# EAGLE design H1BR7 (EAGLE 9.6.1)

## Sheet 1 of 2
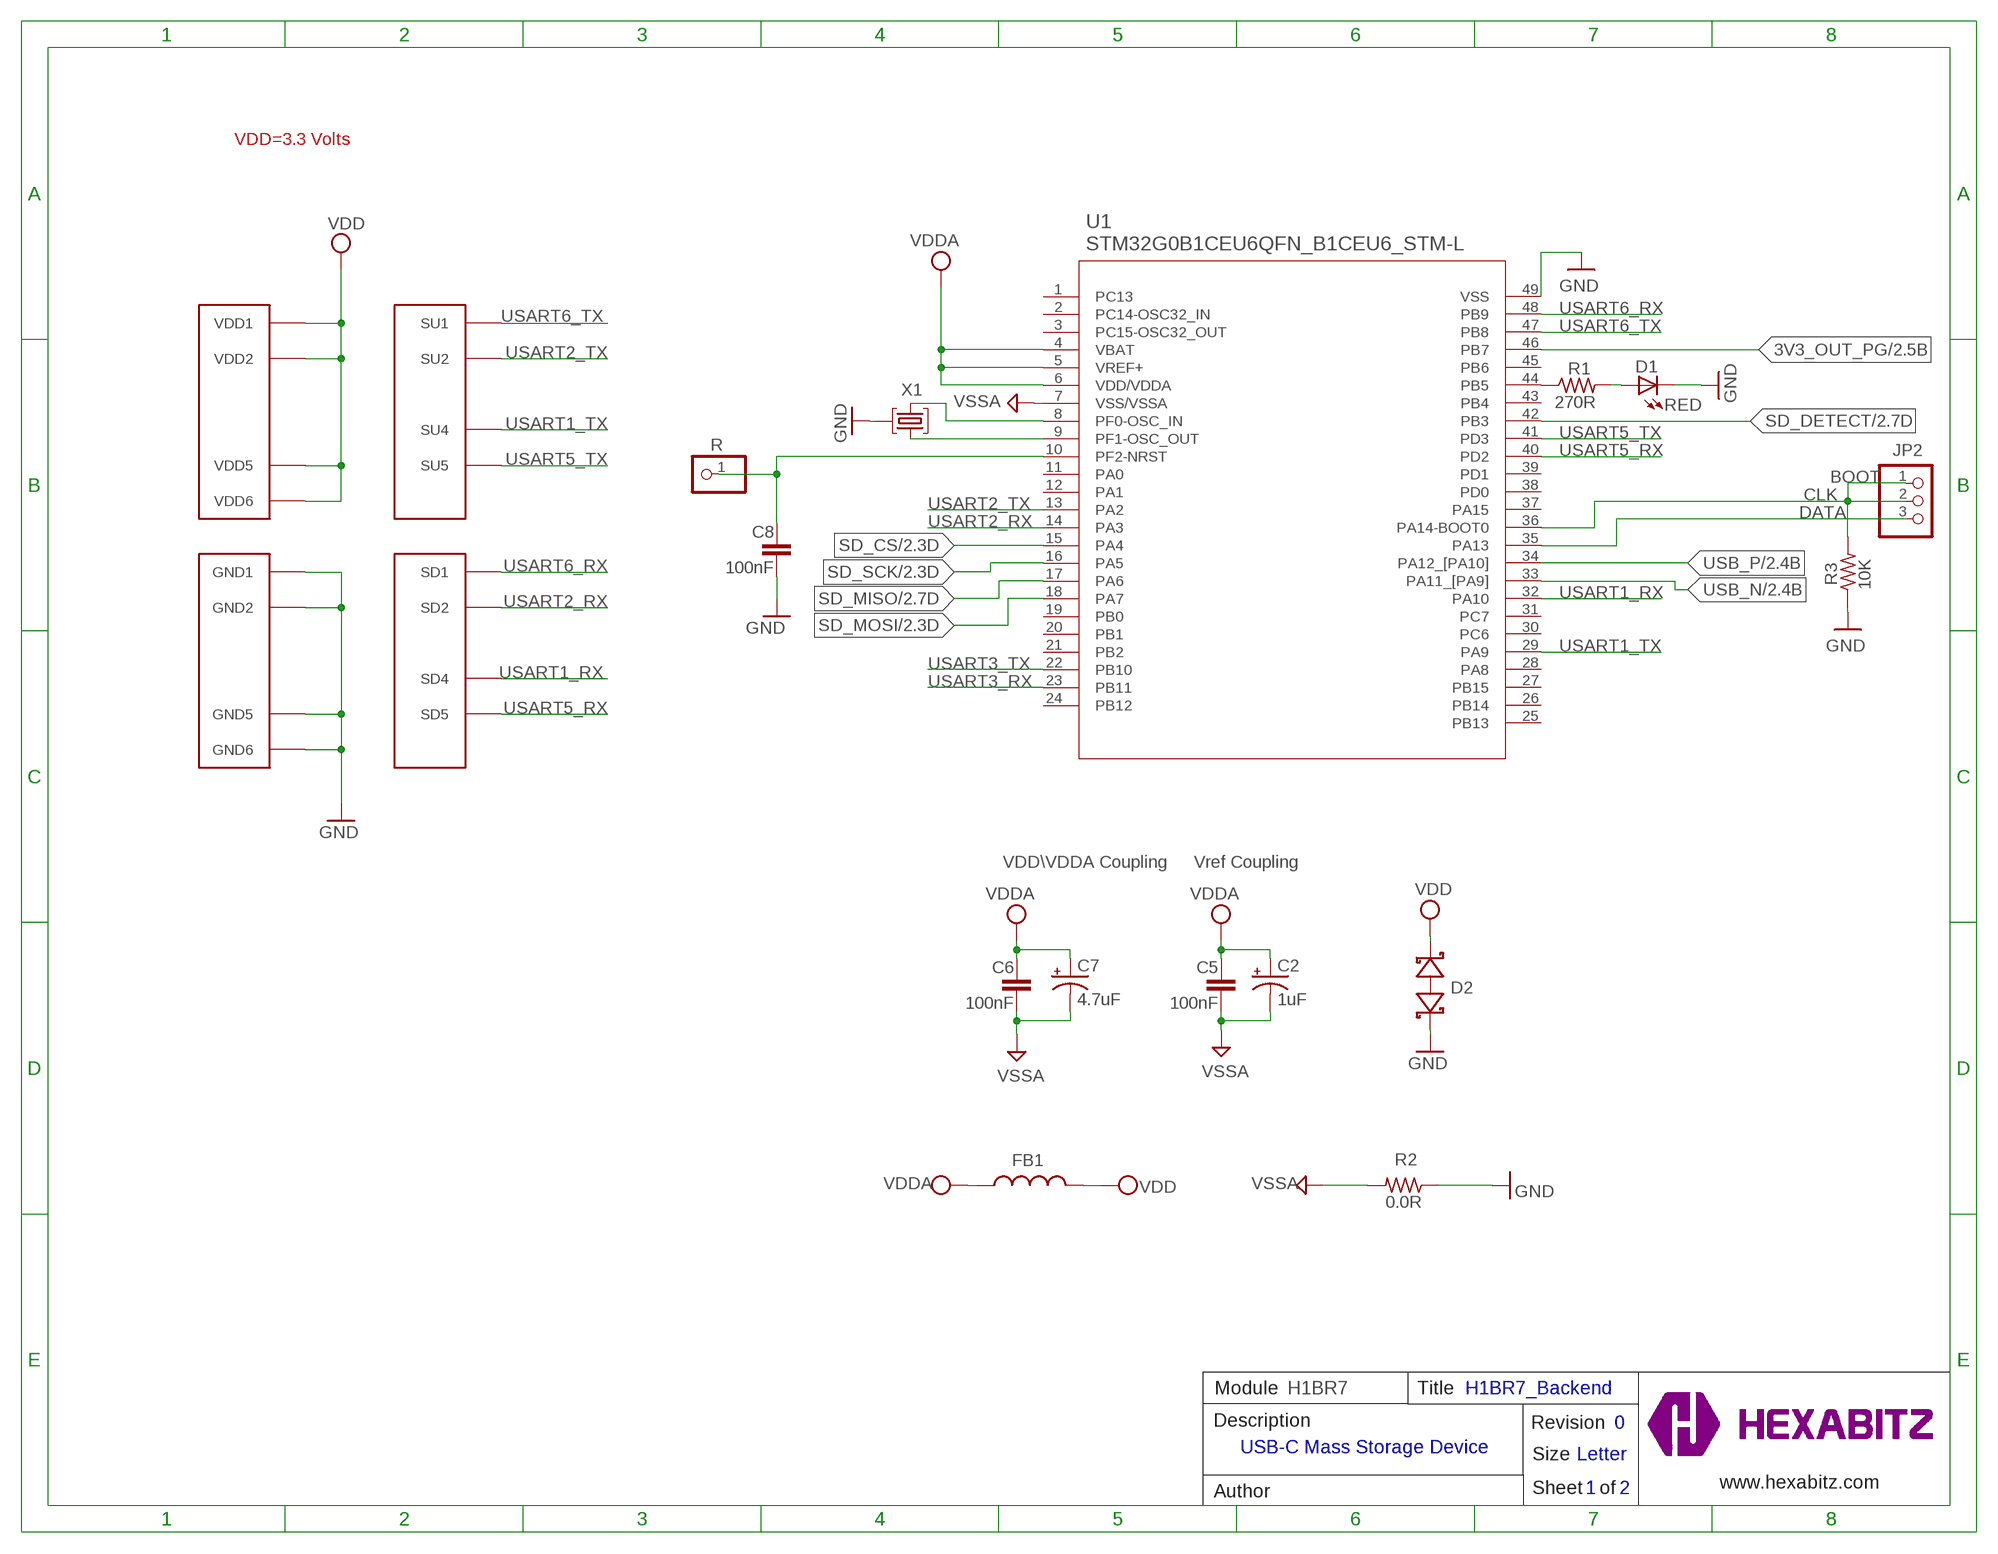
[diagram p0: schematic, sheet 1]

### Parts
C2  1uF  C-0805-POL  [C-0805-POL]
C5  100nF  C-0603  [C-0603]
C6  100nF  C-0603  [C-0603]
C7  4.7uF  C-0805-POL  [C-0805-POL]
C8  100nF  C-0603  [C-0603]
D1  RED  VLMS1300-GS08  [VLMS1300-GS08]
D2  BOURNS_CDSOD323-T03SCBOURNS_CDSOD323-T03SC_0_0  [BOURNS_CDSOD323-T03SC_0]
FB1  FB-TDK_MMZ1608Y300B  [FB-TDK_MMZ1608Y300B]
JP2  PINHD-1X3  [1X03]
P1  HEXABIT_HEXABIT_?_NO_P3_P6_P9_P10  HEXABIT_HEXABIT_?_NO_P3_P6_P9_P10_NO_P3_P6_P9_P10  [HEXABIT_?_NO_P3_P6_P9_P10]
R  R  PINHD-1X1  [1X01]
R1  270R  R-0603  [R-0603]
R2  0.0R  R-0603  [R-0603]
R3  10K  R-0603  [R-0603]
TRIMBLE-LOGO1  HEXA-LOGO  [HEXA-LOGO]
U1  STM32G0B1CEU6QFN_B1CEU6_STM-L  [QFN_B1CEU6_STM-L]
X1  XTALL_CSTCE8M00G52  [XTALL_CSTCE8M00G52]

### Nets
3V3_OUT_PG: U1.46(PB7) ; also sheet 2
CLK: JP2.1 JP2.2 R3.2 U1.36(PA14-BOOT0)
DATA: JP2.3 U1.35(PA13)
GND: C8.2 D1.C D2.1(A) P1.PAD_PD7(GND1) P1.PAD_PD8(GND2) P1.PAD_PD11(GND5) P1.PAD_PD12(GND6) R2.1 R3.1 U1.49(VSS) X1.P$2 ; also sheet 2
N$2: R1.1 U1.44(PB5)
N$3: D1.A R1.2
N$4: C8.1 R.1 U1.10(PF2-NRST)
N$5: U1.9(PF1-OSC_OUT) X1.P$1
N$6: U1.8(PF0-OSC_IN) X1.P$3
SD_CS: U1.15(PA4) ; also sheet 2
SD_DETECT: U1.42(PB3) ; also sheet 2
SD_MISO: U1.17(PA6) ; also sheet 2
SD_MOSI: U1.18(PA7) ; also sheet 2
SD_SCK: U1.16(PA5) ; also sheet 2
USART1_RX: P1.PAD_PD4(SD4) U1.32(PA10)
USART1_TX: P1.PAD_PU4(SU4) U1.29(PA9)
USART2_RX: P1.PAD_PD2(SD2) U1.14(PA3)
USART2_TX: P1.PAD_PU2(SU2) U1.13(PA2)
USART3_RX: U1.23(PB11)
USART3_TX: U1.22(PB10)
USART5_RX: P1.PAD_PD5(SD5) U1.40(PD2)
USART5_TX: P1.PAD_PU5(SU5) U1.41(PD3)
USART6_RX: P1.PAD_PD1(SD1) U1.48(PB9)
USART6_TX: P1.PAD_PU1(SU1) U1.47(PB8)
USB_N: U1.33(PA11_[PA9]) ; also sheet 2
USB_P: U1.34(PA12_[PA10]) ; also sheet 2
VDD: D2.2(C) FB1.2 P1.PAD_PU7(VDD1) P1.PAD_PU8(VDD2) P1.PAD_PU11(VDD5) P1.PAD_PU12(VDD6) ; also sheet 2
VDDA: C2.1(+) C5.1 C6.1 C7.1(+) FB1.1 U1.4(VBAT) U1.5(VREF+) U1.6(VDD/VDDA)
VSSA: C2.2(-) C5.2 C6.2 C7.2(-) R2.2 U1.7(VSS/VSSA)
Unconnected: U1.1(PC13) U1.2(PC14-OSC32_IN) U1.3(PC15-OSC32_OUT) U1.11(PA0) U1.12(PA1) U1.19(PB0) U1.20(PB1) U1.21(PB2) U1.24(PB12) U1.25(PB13) U1.26(PB14) U1.27(PB15) U1.28(PA8) U1.30(PC6) U1.31(PC7) U1.37(PA15) U1.38(PD0) U1.39(PD1) U1.43(PB4) U1.45(PB6)

### Notes on the sheet
- VDD=3.3 Volts
- BOOT
- VDD\VDDA Coupling | Vref Coupling
- Module | H1BR7 | Title | H1BR7_Backend
- Description | Revision | 0
- USB-C Mass Storage Device
- Size | Letter
- www.hexabitz.com
- Author | Sheet   of | 1 | 2
- C:/Users/Admin/Desktop/logodraft.bmp

## Sheet 2 of 2
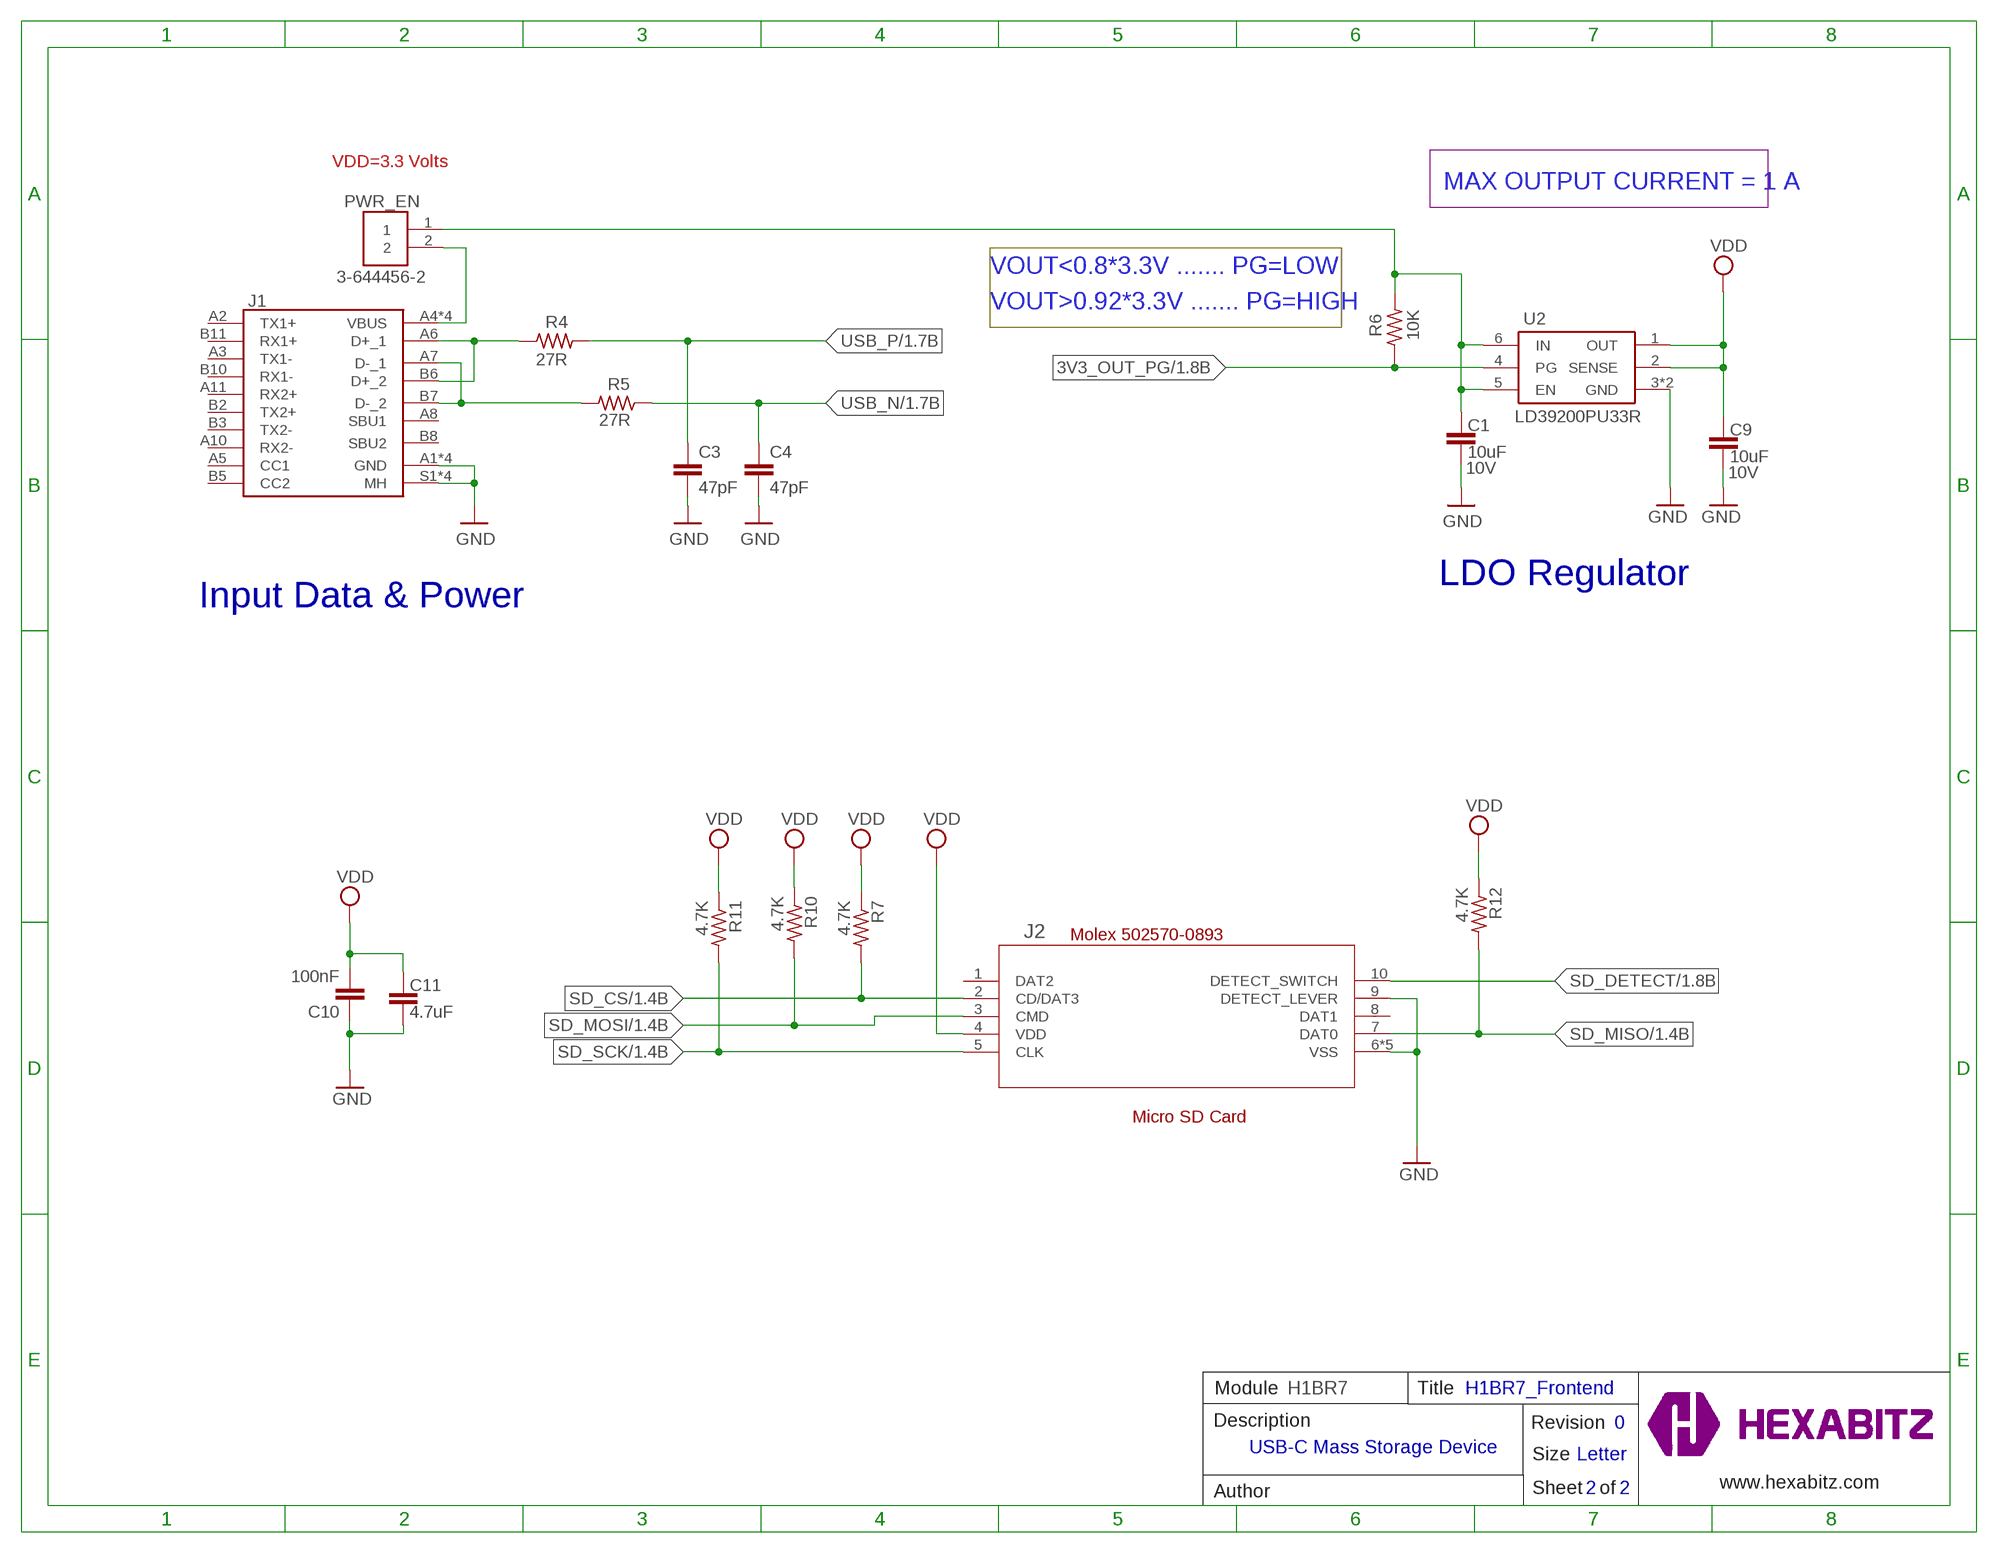
[diagram p1: schematic, sheet 2]

### Parts
C1  10uF  C-0805  [C-0805]
C3  47pF  C-0603  [C-0603]
C4  47pF  C-0603  [C-0603]
C9  10uF  C-0805  [C-0805]
C10  100nF  C-0603  [C-0603]
C11  4.7uF  C-0805  [C-0805]
J1  12401610E4#2A12401610E42A  [AMPHENOL_12401610E4_2A]
J2  5025700893502570-0893_MOL  [502570-0893_MOL]
PWR_EN  3-644456-2  [TE_3-644456-2]
R4  27R  R-0603  [R-0603]
R5  27R  R-0603  [R-0603]
R6  10K  R-0603  [R-0603]
R7  4.7K  R-0603  [R-0603]
R10  4.7K  R-0603  [R-0603]
R11  4.7K  R-0603  [R-0603]
R12  4.7K  R-0603  [R-0603]
U2  LD39200PU33R  [SON95P300X300X100-7N]

### Nets
3V3_OUT_PG: R6.1 U2.4(PG) ; also sheet 1
D_N: J1.A7(D-_1) J1.B7(D-_2) R5.2
D_P: J1.A6(D+_1) J1.B6(D+_2) R4.1
GND: C1.1 C3.2 C4.2 C9.1 C10.1 C11.1 J1.A1(GND) J1.A12(GND) J1.B1(GND) J1.B12(GND) J1.S1(MH) J1.S2(MH) J1.S3(MH) J1.S4(MH) J2.6(VSS) J2.9(DETECT_LEVER) J2.11(VSS) J2.12(VSS) J2.13(VSS) J2.14(VSS) U2.3(GND) U2.7(GND) ; also sheet 1
N$1: C1.2 PWR_EN.1 R6.2 U2.5(EN) U2.6(IN)
N$8: J1.A4(VBUS) J1.A9(VBUS) J1.B4(VBUS) J1.B9(VBUS) PWR_EN.2
SD_CS: J2.2(CD/DAT3) R7.2 ; also sheet 1
SD_DETECT: J2.10(DETECT_SWITCH) ; also sheet 1
SD_MISO: J2.7(DAT0) R12.2 ; also sheet 1
SD_MOSI: J2.3(CMD) R10.2 ; also sheet 1
SD_SCK: J2.5(CLK) R11.2 ; also sheet 1
USB_N: C4.1 R5.1 ; also sheet 1
USB_P: C3.1 R4.2 ; also sheet 1
VDD: C9.2 C10.2 C11.2 J2.4(VDD) R7.1 R10.1 R11.1 R12.1 U2.1(OUT) U2.2(SENSE) ; also sheet 1
Unconnected: J1.A2(TX1+) J1.A3(TX1-) J1.A5(CC1) J1.A8(SBU1) J1.A10(RX2-) J1.A11(RX2+) J1.B2(TX2+) J1.B3(TX2-) J1.B5(CC2) J1.B8(SBU2) J1.B10(RX1-) J1.B11(RX1+) J2.1(DAT2) J2.8(DAT1)

### Notes on the sheet
- VDD=3.3 Volts
- MAX OUTPUT CURRENT = 1 A
- VOUT<0.8*3.3V ....... PG=LOW
- VOUT>0.92*3.3V ....... PG=HIGH
- LDO Regulator
- Input Data & Power
- Molex 502570-0893
- Micro SD Card
- Module | H1BR7 | Title | H1BR7_Frontend
- Description | Revision | 0
- USB-C Mass Storage Device
- Size | Letter
- www.hexabitz.com
- Author | Sheet   of | 2 | 2

## Library data of the parts
C1 C9 C11 = HEXABITZ_RCLS:C-0805: CAP CER 10% X7R 0805; MPN: GRM187R61A226ME15; VOLTAGE_RATING: 10V
C2 C7 = HEXABITZ_RCLS:C-0805-POL: Cap Tant Solid SMD 2012
C3-C6 C8 = HEXABITZ_RCLS:C-0603: CAP CER 10% X7R 0603
C10 = HEXABITZ_RCLS:C-0603: CAP CER 10% X7R 0603; CAPACITANCE: 100nF; MFN: AVX CORPORATION; MPN: '0603YC104K4T2A; OCTOPART_URL: 'https://octopart.com/0603yc104k4t2a-avx+interconnect+%2F+elco-8120651; TOLERANCE: 10%; VOLTAGE_RATING: 16.0 V
D1 = Hexabitz:VLMS1300-GS08: Red 0603 130° Clear 54 mcd 2 V Surface Mount ChipLED ; Octopart Url : http://octopart.com/vlms1300-gs08-vishay-21709201; MFN: Vishay; MPN: VLMS1300-GS08; OCTOPART_URL: https://octopart.com/vlms1300-gs08-vishay-21709201?r=sp&s=_gcP4_q8T1SC6PJQPTQ9yA
D2 = HEXABITZ_RCLS:BOURNS_CDSOD323-T03SC: CDSOD323-TxxSC - TVS Diode Series; DESCRIPTION: Dio Tvs Vwm 03V 500W Bidir Sod323 / Tape & Reel - 7" Reel; MFN: Bourns; MPN: CDSOD323-T03SC; OCTOPART_URL: https://octopart.com/cdsod323-t03sc-bourns-10487153?r=sp
FB1 = HEXABITZ_RCLS:FB-TDK_MMZ1608Y300B: Ferrite Beads Multi-Layer 30Ohm 25% 100MHz 1.5A 50mOhm DCR 0603; MFN: TDK; MPN: MMZ1608Y300B; OCTOPART_URL: https://octopart.com/mmz1608y300b-tdk-368280?r=sp&s=cd9_2ZEqQ9q9UNBuQgHAiA
J1 = HEXABITZ_CONNECTION_PARTS:12401610E4#2A: USB3.2 GEN2, Type C, Top mount, CH 1.58mm, Dual Row SMT Source: Datasheet <https://cdn.amphenol-cs.com/media/wysiwyg/files/drawing/c12401610_c.pdf>
J2 = HEXABITZ_CONNECTION_PARTS:5025700893; COPYRIGHT: Copyright (C) 2022 Ultra Librarian. All rights reserved.; DIGI-KEY_PART_NUMBER_1: WM19093TR-ND; DIGI-KEY_PART_NUMBER_2: WM19093CT-ND; DIGI-KEY_PART_NUMBER_3: WM19093DKR-ND; DIGI-KEY_PART_NUMBER_4: WM19093TR-NDL; MANUFACTURER_PART_NUMBER: 5025700893; MFR_NAME: Molex Connector Corporation; OCTOPART_URL: https://octopart.com/502570-0893-molex-42270318?r=sp
JP2 = pinhead:PINHD-1X3: PIN HEADER
P1 = hexabitz_connectors:HEXABIT_?_NO_P3_P6_P9_P10: Hexabitz Hexagon Module Connector Hexagon side length = 17.32mm. The following ports are removed: P3 P6 P9 P10
PWR_EN = HEXABITZ_USER_INTERFACE_PARTS:3-644456-2; AVAILABILITY: Unavailable; CENTERLINE_PITCH: 2.54 mm[.1 in]; COMMENT: 3-644456-2; DESCRIPTION: Connector Unshrouded Header HDR 2 Position 2.54mm Solder Straight Thru-Hole; EU_ROHS_COMPLIANCE: Compliant; MF: TE Connectivity; MFN: TE Connectivity; MP: 3-644456-2; MPN: 87224-1; NUMBER_OF_POSITIONS: 2; OCTOPART_URL: https://octopart.com/87224-1-te+connectivity-39512011?r=sp; PACKAGE: None; PRICE: None; PRODUCT_TYPE: Connector; TE_PURCHASE_URL: https://www.te.com/usa-en/product-3-644456-2.html?te_bu=Cor&te_type=disp&te_campaign=seda_glo_cor-seda-global-disp-prtnr-fy19-seda-model-bom-cta_sma-317_1&elqCampaignId=32493
R = HEXABITZ_USER_INTERFACE_PARTS:PINHD-1X1: PIN HEADER; MFN: TE Connectivity; MPN: 87227-1; OCTOPART_URL: https://octopart.com/87227-1-te+connectivity-39512052?r=sp
R1 R3 = HEXABITZ_RCLS:R-0603: Thick Film Resistors - SMD 0603
R2 = HEXABITZ_RCLS:R-0603: Thick Film Resistors - SMD 0603; MFN: Yageo; MPN: RC0603JR-070RL; OCTOPART_URL: https://octopart.com/rc0603jr-070rl-yageo-1241539?r=sp&s=X2NteqRjRNWrnx42Y0aliA; RESISTANCE: 0.0 Ohm
R4-R6 = HEXABITZ_RCLS:R-0603: Thick Film Resistors - SMD 0603; TOLERANCE: 1%
R7 R10-R12 = HEXABITZ_RCLS:R-0603: Thick Film Resistors - SMD 0603; MFN: YAGED [VA]; MPN: RC0603JR-074K7L; OCTOPART_URL: 'https://octopart.com/rc0603jr-074k7l-yageo-55458509?r=sp; RESISTANCE: 4700 Ohm; TOLERANCE: 5%
TRIMBLE-LOGO1 = HEXABITZ_USER_INTERFACE_PARTS:HEXA-LOGO: Trimble-Logo
U1 = HEXABITZ_ICs:STM32G0B1CEU6; COPYRIGHT: Copyright (C) 2021 Ultra Librarian. All rights reserved.; MANUFACTURER_PART_NUMBER: STM32G0B1CEU6; MFR_NAME: STMicroelectronics
U2 = HEXABITZ_ICs:LD39200PU33R: LDO Voltage Regulators 2 A high PSRR ultra low drop linear regulator with reverse current protection Source: Datasheet <https://www.st.com/resource/en/datasheet/ld39200.pdf>; DESCRIPTION: LDO Voltage Regulators 2 A high PSRR ultra low drop linear regulator with reverse current protection; HEIGHT: 1mm; MANUFACTURER_NAME: STMicroelectronics; MANUFACTURER_PART_NUMBER: LD39200PU33R; MOUSER_PART_NUMBER: 511-LD39200PU33R; MOUSER_PRICE-STOCK: https://www.mouser.co.uk/ProductDetail/STMicroelectronics/LD39200PU33R?qs=WHlX%252B%252B9%2FRwAl6%2FJDqRS1uw%3D%3D
X1 = Hexabitz:XTALL_CSTCE8M00G52: MURATA CSTCE8M00G52-R0 RESONATOR, SMD, 8MHZ ; Octopart Url : https://octopart.com/cstce8m00g52-r0-murata-7145559; MFN: Murata; MPN: CSTCE8M00G52Z-R0; OCTOPART_URL: https://octopart.com/cstce8m00g52z-r0-murata-17755941?r=sp&s=JDnNJnrHQhyS8Zk4ofFWXw

## Board
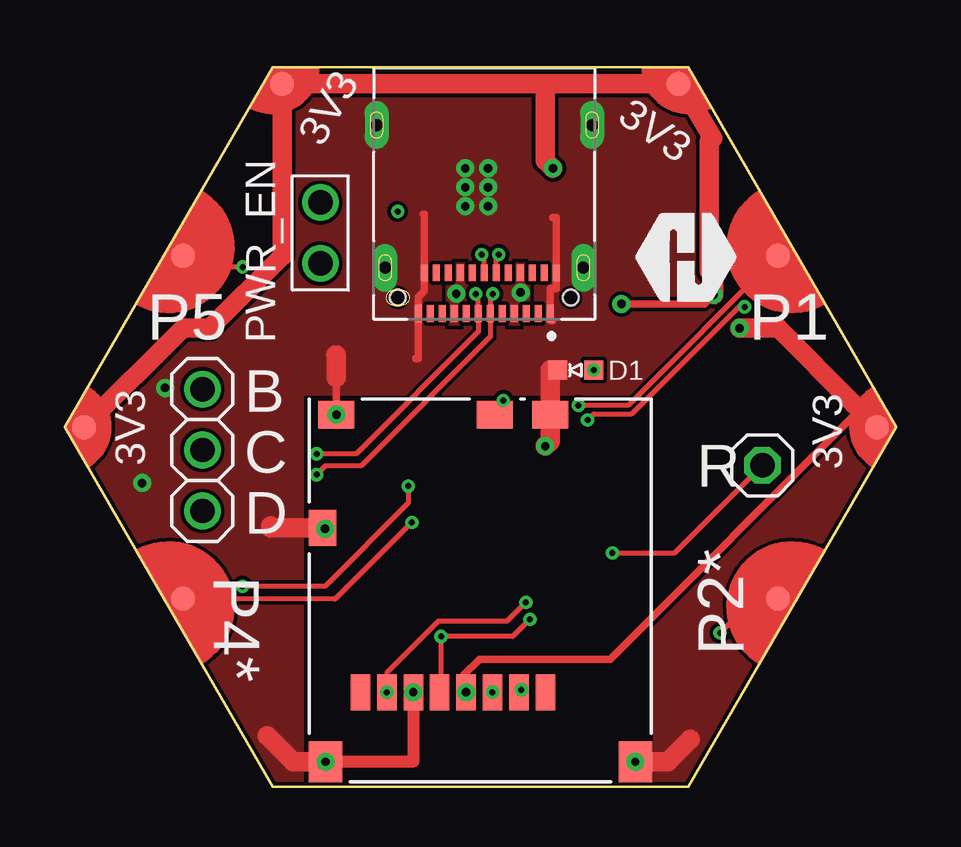
[diagram p2: board, top side]
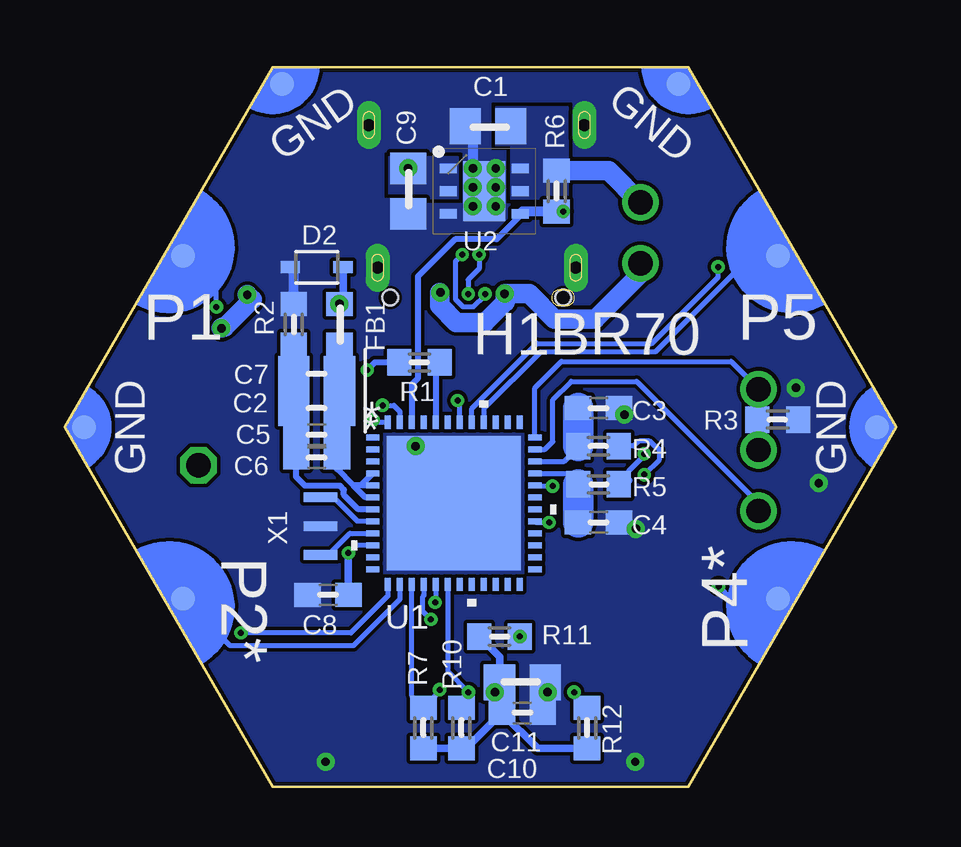
[diagram p3: board, bottom side, seen from below]

Size 34.64 x 30 mm. Coordinates in mm from the lower left corner, seen from the top.
Copper layers (1*16): Top 0.035mm / dielectric 1.5mm / Bottom 0.035mm
Design rules "default *": minimum track width 6mil, minimum drill 0.25mm, track to track 6mil, track to pad 6mil, pad to pad 6mil, via to via 6mil, smd to smd 0mil, copper to edge 0.15mm, drill to drill 1mil, minimum pad ring 10mil, minimum via ring 6mil, stop-mask expansion 4mil, vias tented up to drill 25mil, thermal gap 10mil

### Footprints (pad centres in the part's own frame; a part is rotated, then mirrored left to right if it is on the bottom)
C-0805 = smd 1.3 x 1.5: 1 -0.95,0; 2 0.95,0
C-0805-POL = smd 1.3 x 1.5: 1 -0.95,0; 2 0.95,0
C-0603 = smd 1.1 x 1: 1 -0.85,0; 2 0.85,0
VLMS1300-GS08 = smd 0.8 x 0.8: A 0,0.75; C 0,-0.75
BOURNS_CDSOD323-T03SC_0 = smd 0.8 x 0.5: 1 -1.1,0; 2 1.1,0
FB-TDK_MMZ1608Y300B = smd 1 x 1.1: 1 -0.85,0; 2 0.85,0
AMPHENOL_12401610E4_2A = smd 0.29 x 0.7: A1 -2.75,0.66; A2 -2.25,0.66; A3 -1.75,0.66; A4 -1.25,0.66; A5 -0.75,0.66; A6 -0.25,0.66; A7 0.25,0.66; A8 0.75,0.66; A9 1.25,0.66; A10 1.75,0.66; A11 2.25,0.66; A12 2.75,0.66; B1 2.5,-1.04; B2 2,-1.04; B3 1.5,-1.04; B4 1,-1.04; B5 0.5,-1.04; B6 0,-1.04; B7 -0.5,-1.04; B8 -1,-1.04; B9 -1.5,-1.04; B10 -2,-1.04; B11 -2.5,-1.04; B12 -3,-1.04 | drill 0.5 pad 0.8 long: S1 -4.13,-1.25; S2 4.13,-1.25; S3 4.49,-7.2; S4 -4.49,-7.2 | hole 0.65: -3.6,0; 3.6,0
502570-0893_MOL = smd 0.813 x 1.499: 1 -2.7,4.249; 2 -1.6,4.249; 3 -0.5,4.249; 4 0.6,4.249; 5 1.7,4.249; 6 2.8,4.249; 7 3.9,4.249; 8 5,4.249 | smd 1.143 x 1.499: 9 6.575,-2.601 | smd 1.499 x 1.143: 10 -0.6,-7.326; 13 -2.9,-7.326; 14 6,-7.326 | smd 1.397 x 1.702: 11 -6.45,7.149; 12 6.45,7.149
1X03 = drill 1.016: 1 -2.54,0; 2 0,0; 3 2.54,0
HEXABIT_?_NO_P3_P6_P9_P10 = smd 1 x 1 bottom: PAD_PD1 12.39,7.15; PAD_PD2 12.39,-7.15; PAD_PD4 -12.39,-7.15; PAD_PD5 -12.39,7.15; PAD_PD7 8.26,14.31; PAD_PD8 16.52,0; PAD_PD11 -16.52,0; PAD_PD12 -8.26,14.31 | smd 1 x 1: PAD_PU1 12.39,7.15; PAD_PU2 12.39,-7.15; PAD_PU4 -12.39,-7.15; PAD_PU5 -12.39,7.15; PAD_PU7 8.26,14.31; PAD_PU8 16.52,0; PAD_PU11 -16.52,0; PAD_PU12 -8.26,14.31
TE_3-644456-2 = drill 1.02 pad 1.37: 1 0,0; 2 2.54,0
1X01 = drill 1.016 octagon: 1 0,0
R-0603 = smd 1 x 1.1: 1 -0.85,0; 2 0.85,0
QFN_B1CEU6_STM-L = smd 0.55 x 0.254: 1 -3.38,2.751; 2 -3.38,2.251; 3 -3.38,1.75; 4 -3.38,1.25; 5 -3.38,0.75; 6 -3.38,0.25; 7 -3.38,-0.25; 8 -3.38,-0.75; 9 -3.38,-1.25; 10 -3.38,-1.75; 11 -3.38,-2.251; 12 -3.38,-2.751; 25 3.38,-2.751; 26 3.38,-2.251; 27 3.38,-1.75; 28 3.38,-1.25; 29 3.38,-0.75; 30 3.38,-0.25; 31 3.38,0.25; 32 3.38,0.75; 33 3.38,1.25; 34 3.38,1.75; 35 3.38,2.251; 36 3.38,2.751 | smd 0.254 x 0.55: 13 -2.751,-3.38; 14 -2.251,-3.38; 15 -1.75,-3.38; 16 -1.25,-3.38; 17 -0.75,-3.38; 18 -0.25,-3.38; 19 0.25,-3.38; 20 0.75,-3.38; 21 1.25,-3.38; 22 1.75,-3.38; 23 2.251,-3.38; 24 2.751,-3.38; 37 2.751,3.38; 38 2.251,3.38; 39 1.75,3.38; 40 1.25,3.38; 41 0.75,3.38; 42 0.25,3.38; 43 -0.25,3.38; 44 -0.75,3.38; 45 -1.25,3.38; 46 -1.75,3.38; 47 -2.251,3.38; 48 -2.751,3.38 | smd 5.6 x 5.6: 49 0,0
SON95P300X300X100-7N = smd 0.7 x 0.4: 1 -1.5,0.95; 2 -1.5,0; 3 -1.5,-0.95; 4 1.5,-0.95; 5 1.5,0; 6 1.5,0.95 | smd 1.75 x 2.5: 7 0,0
XTALL_CSTCE8M00G52 = smd 1.4 x 0.4: P$1 0,1.2; P$2 0,0; P$3 0,-1.2

### Placement (x,y rotation side)
C1  17,27.54 0 bottom
C2  24.15,15.79 180 bottom
C3  12.4,15.79 0 bottom
C4  12.4,11.03 0 bottom
C5  24.15,14.68 180 bottom
C6  24.15,13.73 180 bottom
C7  24.15,17.22 180 bottom
C8  23.67,8.01 180 bottom
C9  20.34,24.84 90 bottom
C10  15.57,3.09 180 bottom
C11  15.57,4.36 180 bottom
D1  21.29,17.38 270 top
D2  24.15,21.67 0 bottom
FB1  23.19,19.29 90 bottom
J1  17.48,20.4 180 top
J2  17.32,8.2 180 top
JP2  5.73,14.05 270 top
P1  17.32,15 0 top
PWR_EN  10.65,24.37 270 top
R  29.07,13.41 0 top
R1  19.86,17.7 180 bottom
R2  25.1,19.29 270 bottom
R3  4.94,15.32 180 bottom
R4  12.4,14.21 180 bottom
R5  12.4,12.62 0 bottom
R6  14.14,24.84 90 bottom
R7  19.7,2.46 90 bottom
R10  18.11,2.46 90 bottom
R11  16.53,6.27 0 bottom
R12  12.88,2.46 90 bottom
TRIMBLE-LOGO1  25.89,20.24 0 top
U1  18.43,11.82 0 bottom
U2  17.16,24.84 0 bottom
X1  23.99,10.87 180 bottom

### Tracks (layer width: path | path; a pad name or v marks a point on that pad's centre or on a via)
3V3_OUT_PG  (via drill 0.25 pad 0.55)
  Bottom 0.254: U2.4 15.63,23.86 16.65,22.84 18.37,22.84 19.93,21.28 19.93,17.03 20.18,16.78 U1.46
  Bottom 0.305: R6.1 v13.87,23.99
  Bottom 0.406: U2.4 15.56,23.99 R6.1
CLK
  Bottom 0.203: U1.36 15.05,16.63 13.95,17.74 6.88,17.74 JP2.1 5.73,15.37 R3.2 5.79,14.1 JP2.2
D_N  (via drill 0.25 pad 0.55)
  Top 0.203: v17.12,20.56 17.17,20.56 17.23,20.49 J1.A7 17.23,18.98 12.14,13.89 v10.49,13.89 | J1.B7 17.98,22.19 v18.08,22.19
  Bottom 0.203: v17.12,20.56 17.12,20.51 17.61,20.02 18.05,20.02 18.36,20.34 18.36,21.91 v18.08,22.19 | v10.49,13.89 10.49,13.83 11.15,13.17 11.15,12.78
  Bottom 0.305: R5.2 11.31,12.62 11.15,12.78
D_P  (via drill 0.25 pad 0.55)
  Top 0.203: v17.83,20.56 17.79,20.56 17.73,20.49 J1.A6 17.73,18.77 12.34,13.39 10.86,13.39 v10.49,13.02 | J1.B6 17.48,22.19 v17.38,22.19
  Bottom 0.203: v17.83,20.56 17.83,21.15 17.38,21.6 v17.38,22.19 | v10.49,13.02 9.86,13.66 9.86,14.05 10.02,14.21 10.06,14.21 10.27,14.42 10.71,14.42 10.93,14.21 R4.1
DATA
  Bottom 0.203: U1.35 14.63,14.08 14.3,14.4 14.3,16.15 13.55,16.9 10.81,16.9 5.73,11.82 JP2.3
GND  (via drill 0.35 pad 0.75)
  Top 0.305: 14.94,23.89 14.98,23.89 J1.B1 14.98,20.68 14.73,20.43 J1.A12 14.73,17.86 14.62,17.86 | 20.34,23.73 20.48,23.73 J1.B12 20.48,20.78 20.23,20.78 J1.A1 20.23,19.44 20.34,19.44 | J2.14 11.32,17.06
  Top 0.508: J2.6 14.52,1.05 J2.12
  Top 0.813: v20.02,14.21 20.22,14.41 J2.13 20.22,17.38 20.34,17.38 | J2.11 25.12,1.05 26.05,1.98 | J2.12 9.52,1.05 8.43,2.14 | 11.32,17.06 11.32,18.02 11.29,18.02 | J2.9 8.59,10.8 8.59,10.87
  Bottom 0.305: C3.2 11.32,15.56 J2.14
  Bottom 0.406: R2.1 25.1,21.52 D2.1 | C1.1 17.64,27.23 v17.64,25.79 | U1.49 19.38,10.87
  Bottom 0.61: J1.S2 13.37,21.67
  Bottom 0.813: J2.6 14.52,4.26 C11.1
  other vias: 16.68,25.79 17.64,25 16.68,25 16.68,24.21 17.64,24.21 10.87,1.05 14.52,3.95 23.77,1.05 11.32,15.53 3.22,12.67 4.18,16.64 10.84,10.76
  pour Top (rank 2, no thermals): 0.25,14.86 8.65,29.92 25.98,29.92 34.59,14.77 25.91,-0.08 8.67,-0.08
  cutout Top: 10.02,16.27 24.46,16.27 24.46,0.08 10.02,0.08
  pour Bottom (rank 2, no thermals): 0.25,14.86 8.65,29.92 25.98,29.92 34.59,14.77 25.91,-0.08 8.67,-0.08
N$1
  Bottom 0.813: PWR_EN.1 11.98,25.69 R6.2
  pour Bottom (no thermals): 13.67,28.34 16.68,28.34 16.68,26.75 16.05,26.75 16.05,24.52 13.67,24.52
N$2
  Bottom 0.254: R1.1 19.18,17.53 U1.44
N$3  (via drill 0.25 pad 0.55)
  Bottom 0.254: R1.2 21.72,17.7 D1.A
  other vias: 22.04,17.38
N$4  (via drill 0.25 pad 0.55)
  Top 0.203: v22.82,9.76 25.42,9.76 R.1
  Bottom 0.203: U1.10 22.51,10.07 v22.82,9.76
  Bottom 0.305: v22.82,9.76 C8.1
N$5
  Bottom 0.203: U1.9 22.76,10.57 23.66,9.67 X1.P$1
N$6
  Bottom 0.203: U1.8 22.44,11.07 23.44,12.07 X1.P$3
N$8  (via drill 0.35 pad 0.75)
  Bottom 0.152: v18.99,20.61 19.02,20.61 | v16.31,20.56 16.31,20.21 16.29,20.21
  Bottom 0.813: PWR_EN.2 10.58,21.83 10.58,21.47 12.54,19.52 14.24,19.52 15.29,20.56 16.29,20.56 16.29,20.21 17.13,19.36 18.33,19.36 19.02,20.06 19.02,20.61
  pour Top (no thermals): 15.89,21.83 15.89,19.29 19.38,19.29 19.38,21.83
SD_CS  (via drill 0.25 pad 0.55)
  Top 0.203: v19.02,4.06 J2.2
  Bottom 0.203: v19.02,4.06 19.02,3.98 R7.2 20.18,3.79 U1.15
SD_DETECT  (via drill 0.25 pad 0.55)
  Top 0.203: v18.27,16.11 18.27,15.88 J2.10
  Bottom 0.203: U1.42 18.18,16.02 v18.27,16.11
SD_MISO  (via drill 0.25 pad 0.55)
  Top 0.203: v19.21,7.7 18.42,6.9 15.56,6.9 13.42,4.76 J2.7
  Bottom 0.203: R12.2 13.42,3.85 J2.7 | U1.17 19.18,7.73 v19.21,7.7
  other vias: 13.42,3.95
SD_MOSI  (via drill 0.25 pad 0.55)
  Bottom 0.203: R10.2 18.11,3.66 J2.3 18.68,4.81 U1.18
  other vias: 17.82,3.95
SD_SCK  (via drill 0.25 pad 0.55)
  Top 0.203: J2.5 15.68,4.01 R11.2 18.66,6.27 v19.38,6.99
  Bottom 0.203: U1.16 19.68,7.98 19.74,7.92 19.74,7.35 v19.38,6.99
  other vias: 15.68,6.27
USART1_RX  (via drill 0.25 pad 0.55)
  Top 0.203: v14.31,12.54 14.31,11.83 10.84,8.36 v7.4,8.36
  Bottom 0.203: U1.32 15.02,12.54 v14.31,12.54 | v7.4,8.36 6.89,7.85 P1.PAD_PD4
USART1_TX  (via drill 0.25 pad 0.55)
  Top 0.203: v14.46,11.03 11.26,7.83 4.5,7.83 4.47,7.86 4.92,7.86 P1.PAD_PU4
  Bottom 0.203: U1.29 15.01,11.03 v14.46,11.03
USART2_RX
  Bottom 0.203: U1.14 20.68,7.83 22.62,5.89 27.75,5.89 P1.PAD_PD2
USART2_TX  (via drill 0.25 pad 0.55)
  Top 0.203: v27.3,6.42 28.73,7.85 P1.PAD_PU2
  Bottom 0.203: U1.13 21.18,7.96 22.72,6.42 v27.3,6.42
USART5_RX
  Bottom 0.203: P1.PAD_PD5 6.02,22.15 10.03,18.14 14.82,18.14 17.18,15.77 U1.40
USART5_TX  (via drill 0.25 pad 0.55)
  Top 0.203: v7.42,21.68 5.4,21.68 P1.PAD_PU5
  Bottom 0.203: U1.41 17.68,15.78 14.96,18.49 10.18,18.49 7.42,21.25 v7.42,21.68
USART6_RX  (via drill 0.25 pad 0.55)
  Top 0.203: v21.79,15.3 22.04,15.55 23.62,15.55 28.08,20.01 v28.32,20.01
  Bottom 0.203: U1.48 21.69,15.2 v21.79,15.3 | v28.32,20.01 28.32,20.76 P1.PAD_PD1
USART6_TX  (via drill 0.25 pad 0.55)
  Top 0.203: P1.PAD_PU1 23.47,15.91 v21.4,15.91
  Bottom 0.203: v21.4,15.91 20.93,15.91 20.68,15.66 U1.47
USB_N
  Bottom 0.203: R5.1 13.71,13.08 U1.33
  Bottom 1.27: R5.1 C4.1
USB_P
  Bottom 0.203: R4.2 13.25,14.16 13.83,13.58 U1.34
  Bottom 1.27: C3.1 R4.2
VDD  (via drill 0.35 pad 0.75)
  Top 0.305: J2.4 16.63,4.04 16.63,4.67 17.29,5.32 22.72,5.32 32.88,15.48 32.88,15.96 | v28.12,19.13 v28.12,19.12 | v27.04,20.52 26.65,20.14 FB1.2
  Top 0.813: P1.PAD_PU11 4.93,19.13 6.05,19.13 9.06,22.14 P1.PAD_PU12 20.02,29.31 | 20.02,29.31 P1.PAD_PU7 25.81,29.08 26.52,27.85 26.99,27.04 26.84,26.89 26.84,21.51 27.04,21.32 v27.04,20.52 | P1.PAD_PU8 32.88,15.96 29.72,19.12 v28.12,19.12 | C9.2 20.02,26.11 20.02,29.31
  Bottom 0.305: R7.1 R10.1 17.91,1.61 C10.2 | R12.1 14.94,1.61 C10.2 | J2.4 16.42,3.65 C10.2 | C10.2 16.42,4.26 C11.2 16.52,5.42 R11.1 | FB1.2 23.05,20.28 D2.2
  Bottom 0.813: v28.12,19.13 28.07,19.18 27.98,19.18 26.83,20.32 v27.04,20.52
  other vias: 20.34,25.79 16.72,3.95 23.19,20.14
  pour Bottom (no thermals): 18.27,24.52 21.13,24.52 21.13,26.27 18.27,26.27
VDDA
  Bottom 0.254: U1.6 22.12,12.07 22.61,12.57 | 22.61,12.57 23.3,13.25 C6.1 C5.1 23.3,15.69 C2.1 C7.1 FB1.1 | U1.5 22.31,12.57 | 22.31,12.57 22.6,12.57 22.61,12.57 | U1.4 22.31,12.57
VSSA
  Bottom 0.254: U1.7 22.41,11.57 23.01,12.18 23.01,12.39 23.17,12.55 24.62,12.55 25,12.93 C6.2 C5.2 25.1,14.78 C2.2 C7.2 R2.2

### Text on the board
tPlace: 3V3 | 3V3 | P5 | P1 | 3V3 | 3V3 | P2* | P4*
bPlace: GND | GND | P5 | P1 | H1BR70 | GND | * | GND | P4* | P2*
tNames: B | C | D
bNames: U1